# Altium schematic sheet PreAmplifierVoltageA.SchDoc
size A4; SheetNumber: 3; SheetTotal: 5
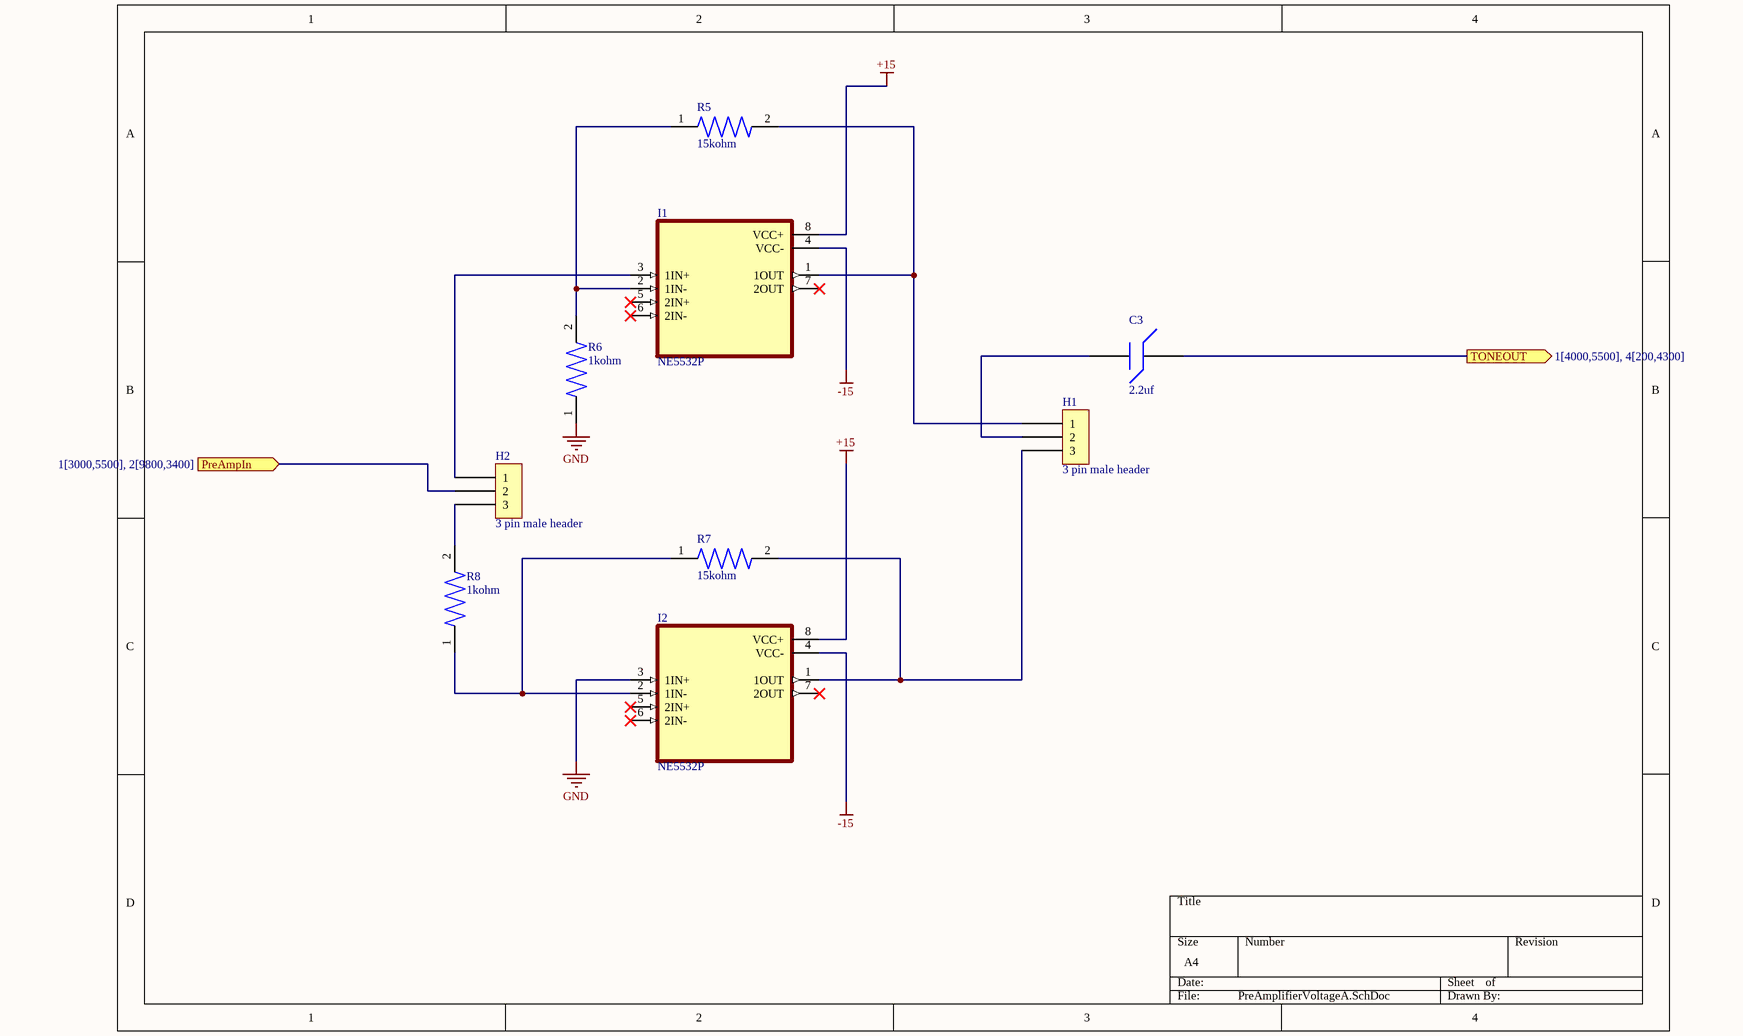
[diagram p0: PreAmplifierVoltageA.SchDoc]

## Parts
C3  2.2uf  [Capasitor]
H1  3 pin male header  [3 pin Male header]
H2  3 pin male header  [3 pin Male header]
I1  NE5532P  [NE5532P]
I2  NE5532P  [NE5532P]
R5  15kohm  [Resistor]
R6  1kohm  [Resistor]
R7  15kohm  [Resistor]
R8  1kohm  [Resistor]

## Ports
PreAmpIn (in, see 1[3000,5500], 2[9800,3400]), TONEOUT (out, see 1[4000,5500], 4[200,4300])

## Nets
+15: I1.8(VCC+) I2.8(VCC+)
-15: I1.4(VCC-) I2.4(VCC-)
GND: I2.3(1IN+) R6.1
PreAmpIn: H2.2 ; port PreAmpIn
TONEOUT: C3.2 ; port TONEOUT
NetC3_1: C3.1 H1.2
NetH1_1: H1.1 I1.1(1OUT) R5.2
NetH1_3: H1.3 I2.1(1OUT) R7.2
NetH2_1: H2.1 I1.3(1IN+)
NetH2_3: H2.3 R8.2
NetI1_2: I1.2(1IN-) R5.1 R6.2
NetI2_2: I2.2(1IN-) R7.1 R8.1

Not connected (* = marked no-connect by the designer): I1 5(2IN+)* 6(2IN-)* 7(2OUT)*; I2 5(2IN+)* 6(2IN-)* 7(2OUT)*

## Library data of the parts
C3 = 400LLE2R2MEFC8X11.5: Aluminum Electrolytic Capacitor, Polarized, Aluminum (wet), 400V, 20% +Tol, 20% -Tol, 2.2uF, Through Hole Mount; Manufacturer: Rubycon; Supplier: Digikey; Supplier Part Number: 1189-1329-ND; Manufacturer Part Number: 400LLE2R2MEFC8X11.5; RoHS: Yes; Category: Aluminum Electrolytic Capacitors; Stock: 36469; Pricing: 1=0.53, 10=0.326, 50=0.2416, 100=0.2148, 500=0.16848, 2000=0.14171, 4000=0.1316, 6000=0.1265 (USD); ComponentLink1URL: https://datasheet.ciiva.com:443/pdfs/VipMasterIC/IC/RUBY/RUBYS01654/RUBYS01654-1.pdf?src-supplier=IHS+Markit; ComponentLink1Description: https://datasheet.ciiva.com:443/pdfs/VipMasterIC/IC/RUBY/RUBYS01654/RUBYS01654-1.pdf?src-supplier=IHS+Markit; ComponentLink2URL: https://datasheet.ciiva.com/29544/e-lle-29544381.pdf?src-supplier=Digikey; ComponentLink2Description: https://datasheet.ciiva.com/29544/e-lle-29544381.pdf?src-supplier=Digikey
H1 H2 = M20-9990345: Board Connector, 3 Contact(s), 1 Row(s), Male, Straight, 0.1 inch Pitch, Solder Terminal, Locking, Black Insulator; Manufacturer: Harwin; Option: General Purpose; Additional Feature: ROHS COMPLIANT; Body/Shell Style: RECEPTACLE; Contact Pattern: RECTANGULAR; Contact Resistance: 25mR; Dielectric Withstanding Voltage (AC): 750V; Durability: 300Cycles; Filter Feature: No; Insulation Resistance: 1GR; Number Of Connectors: 1; Rated Current (Signal): 3A; Number of Contacts: 3; Body Length: 0.3inch; Reference Standard: UL; Reliability: COMMERCIAL; Supplier: Digikey; Supplier Part Number: 952-2263-ND; Manufacturer Part Number: M20-9990345; RoHS: Yes; Category: Headers and Wire Housings; Stock: 57860; Pricing: 1=0.15, 10=0.124, 100=0.1053, 500=0.09398, 1000=0.08949, 5000=0.07987, 10000=0.07606 (USD); Mounting Technology: Board; Contact Material: Brass; Contact Finish - Mating: GOLD; Contact Finish - Termination: Gold (Au) - with Nickel (Ni) barrier; Insulation Color: Black; Insulation Material: Nylon; Min Operating Temperature: -40°C; Max Operating Temperature: 105°C; Connector Type: BOARD CONNECTOR; JESD-609 Code: e4; Contact Gender: Male; Mixed Contacts: No; Mounting Style: STRAIGHT; Number Of PCB Rows: 1; Number of Rows Loaded: 1; Termination: Solder; Body Breadth: 0.1inch; Body Depth: 0.1inch; Mating Contact Pitch: 0.1inch; Mounting Option 1: LOCKING; Terminal Length: 0.118inch; Terminal Pitch: 2.54mm; Flammability Rating: UL94 V-0; DIN Conformance: No; IEC Conformance: No; MIL Conformance: No; Reach SVHC Compliant: Yes; RoHS Compliant: Yes; ComponentLink1URL: https://datasheet.ciiva.com:443/pdfs/VipMasterIC/IC/HRWN/HRWN-S-A0003033920/HRWN-S-A0003397280-1.pdf?src-supplier=IHS+Markit; ComponentLink1Description: https://datasheet.ciiva.com:443/pdfs/VipMasterIC/IC/HRWN/HRWN-S-A0003033920/HRWN-S-A0003397280-1.pdf?src-supplier=IHS+Markit; ComponentLink2URL: https://datasheet.ciiva.com/11747/0900766b80da602d-11747505.pdf?src-supplier=Rs; ComponentLink2Description: https://datasheet.ciiva.com/11747/0900766b80da602d-11747505.pdf?src-supplier=Rs; ComponentLink3URL: https://datasheet.ciiva.com/5160/m20-999-351179-5160492.pdf?src-supplier=Mouser; ComponentLink3Description: https://datasheet.ciiva.com/5160/m20-999-351179-5160492.pdf?src-supplier=Mouser; ComponentLink4URL: https://datasheet.ciiva.com/10151/m20-999-10151334.pdf?src-supplier=Avnet; ComponentLink4Description: https://datasheet.ciiva.com/10151/m20-999-10151334.pdf?src-supplier=Avnet
I1 I2 = NE5532P: Operational Amplifier, 2 Func, 5000uV Offset-Max, BIPolar, PDIP8; Manufacturer: Texas Instruments; Package Body Material: Plastic; Architecture: VOLTAGE-FEEDBACK; Average Bias Current-Max (IIB): 1uA; Bias Current-Max (IIB) @25C: 800nA; Common-mode Reject Ratio-Nom: 100dB; Frequency Compensation: YES; Input Offset Voltage-Max: 5mV; Low-Offset: No; Neg Supply Voltage Limit-Max: -22V; Neg Supply Voltage-Nom (Vsup): -15V; Channels: 2; Package Equivalence Code: DIP8,.3; Power Supplies: +-5/+-15/10/30V; Slew Rate: 9V/µs; Max Supply Current: 16mA; Supply Voltage Limit-Max: 22V; Nominal Supply Voltage: 15V; Surface Mount: No; Unity Gain BW-Nom: 10MHz; Voltage Gain-Min: 10000; Common Mode Rejection Ratio-Min: 70dB; Qualification Status: Not Qualified; Supplier: Mouser; Supplier Part Number: 595-NE5532P; Manufacturer Part Number: NE5532P; RoHS: Yes; Category: Amplifiers - Op Amps, Buffer, Instrumentation; Stock: 14297; Pricing: 1=0.57, 10=0.402, 50=0.335, 100=0.313, 1000=0.266, 10000=0.254 (USD); Case/Package: DIP; Pins: 8; Package Shape: Rectangular; Terminal Finish: Tin; Min Operating Temperature: 0°C; Max Operating Temperature: 70°C; JESD-609 Code: e3; Amplifier Type: OPERATIONAL AMPLIFIER; JESD-30 Code: R-PDIP-T8; Package Style: IN-LINEMeter; Packaging: Rail/Tube; Technology: BIPOLAR; Terminal Form: Through Hole; Terminal Position: DUAL; Length: 9.81mm; Width: 7.62mm; Height - Seated (Max): 5.08mm; Terminal Pitch: 2.54mm; Temperature Grade: COMMERCIAL; Reach SVHC Compliant: Yes; RoHS Compliant: Yes; ComponentLink1URL: https://www.ti.com:443/lit/ds/symlink/ne5532.pdf?src-supplier=IHS+Markit; ComponentLink1Description: https://www.ti.com:443/lit/ds/symlink/ne5532.pdf?src-supplier=IHS+Markit; ComponentLink2URL: https://datasheet.ciiva.com/14151/jyne5532-e-14151126.pdf?src-supplier=Distrelec; ComponentLink2Description: https://datasheet.ciiva.com/14151/jyne5532-e-14151126.pdf?src-supplier=Distrelec; ComponentLink3URL: https://datasheet.ciiva.com/27050/903963-27050795.pdf?src-supplier=Jameco; ComponentLink3Description: https://datasheet.ciiva.com/27050/903963-27050795.pdf?src-supplier=Jameco; ComponentLink4URL: https://datasheet.ciiva.com/15129/getdatasheetpartid-41254-15129711.pdf?src-supplier=Verical; ComponentLink4Description: https://datasheet.ciiva.com/15129/getdatasheetpartid-41254-15129711.pdf?src-supplier=Verical; ComponentLink5URL: https://datasheet.ciiva.com/26325/151768-da-01-en-ne-5532p-26325914.pdf?src-supplier=Conrad; ComponentLink5Description: https://datasheet.ciiva.com/26325/151768-da-01-en-ne-5532p-26325914.pdf?src-supplier=Conrad; ComponentLink6URL: https://datasheet.ciiva.com/1803/ne5532-1803186.pdf?src-supplier=Digikey; ComponentLink6Description: https://datasheet.ciiva.com/1803/ne5532-1803186.pdf?src-supplier=Digikey; ComponentLink7URL: https://datasheet.ciiva.com/2973/sa5532a-2973704.pdf?src-supplier=Avnet; ComponentLink7Description: https://datasheet.ciiva.com/2973/sa5532a-2973704.pdf?src-supplier=Avnet
R5 R7 = CFM12JT15K0: Fixed Resistor, Carbon Film, 0.5W, 15000ohm, 350V, 5% +/-Tol, -500,0ppm/Cel, Through Hole Mount; Manufacturer: Stackpole Electronics; Power: 500mW; Rated Temperature: 70°C; Value: 15kR; Temperature Coefficient (ppm/Cel): 500; Lead Diameter: 0.55mm; Lead Length: 28mm; Package Length: 6mm; Supplier: Digikey; Supplier Part Number: S15KHCT-ND; Manufacturer Part Number: CFM12JT15K0; RoHS: Yes; Category: Through-Hole Resistors; Stock: 89193; Pricing: 1=0.1, 10=0.031, 25=0.0256, 50=0.0224, 100=0.0197, 250=0.01668, 500=0.01478, 1000=0.01316 (USD); Mounting Technology: Through Hole; Pins: 2; Package Shape: Tubular; Terminal Finish: Tin; Min Operating Temperature: -55°C; Max Operating Temperature: 155°C; Tolerance: 5%; JESD-609 Code: e3; Resistor Type: FIXED RESISTOR; Construction: Tubular; Package Style: AXIAL; Packaging: Tape and Reel; Technology: CARBON FILM; Termination: Wire; Working Voltage: 350V; Reach SVHC Compliant: Yes; RoHS Compliant: Yes; ComponentLink1URL: https://datasheet.ciiva.com:443/pdfs/VipMasterIC/IC/SEIE/SEIE-S-A0009883960/SEIE-S-A0009883960-1.pdf?src-supplier=IHS+Markit; ComponentLink1Description: https://datasheet.ciiva.com:443/pdfs/VipMasterIC/IC/SEIE/SEIE-S-A0009883960/SEIE-S-A0009883960-1.pdf?src-supplier=IHS+Markit; ComponentLink2URL: https://www.seielect.com/catalog/SEI-Packaging.pdf?src-supplier=Digikey; ComponentLink2Description: https://www.seielect.com/catalog/SEI-Packaging.pdf?src-supplier=Digikey; ComponentLink3URL: https://www.seielect.com/catalog/sei-cf_cfm.pdf?src-supplier=Digikey; ComponentLink3Description: https://www.seielect.com/catalog/sei-cf_cfm.pdf?src-supplier=Digikey; ComponentLink4URL: https://www.seielect.com/catalog/SEI-CF_CFM.pdf?src-supplier=Avnet; ComponentLink4Description: https://www.seielect.com/catalog/SEI-CF_CFM.pdf?src-supplier=Avnet
R6 R8 = CF14JT1K00: Fixed Resistor, Carbon Film, 0.25W, 1000ohm, 350V, 5% +/-Tol, -400,0ppm/Cel, Through Hole Mount; Manufacturer: Stackpole Electronics; Power: 250mW; Rated Temperature: 70°C; Value: 1kR; Temperature Coefficient (ppm/Cel): 400; Lead Diameter: 0.55mm; Lead Length: 28mm; Package Length: 6mm; Supplier: Digikey; Supplier Part Number: CF14JT1K00CT-ND; Manufacturer Part Number: CF14JT1K00; RoHS: Yes; Category: Through-Hole Resistors; Stock: 680385; Pricing: 1=0.1, 10=0.026, 25=0.022, 50=0.0192, 100=0.0169, 250=0.01424, 500=0.0126, 1000=0.0112 (USD); Mounting Technology: Through Hole; Pins: 2; Package Shape: Tubular; Terminal Finish: Tin; Min Operating Temperature: -55°C; Max Operating Temperature: 155°C; Tolerance: 5%; Resistor Type: FIXED RESISTOR; Construction: Tubular; Package Style: AXIAL; Packaging: Tape and Reel; Technology: CARBON FILM; Termination: Wire; Working Voltage: 350V; JESD-609 Code: e3; Reach SVHC Compliant: Yes; RoHS Compliant: Yes; ComponentLink1URL: https://datasheet.ciiva.com:443/pdfs/VipMasterIC/IC/SEIE/SEIE-S-A0009883960/SEIE-S-A0009883960-1.pdf?src-supplier=IHS+Markit; ComponentLink1Description: https://datasheet.ciiva.com:443/pdfs/VipMasterIC/IC/SEIE/SEIE-S-A0009883960/SEIE-S-A0009883960-1.pdf?src-supplier=IHS+Markit; ComponentLink2URL: https://www.seielect.com/catalog/SEI-Packaging.pdf?src-supplier=Digikey; ComponentLink2Description: https://www.seielect.com/catalog/SEI-Packaging.pdf?src-supplier=Digikey; ComponentLink3URL: https://www.seielect.com/Catalog/SEI-CF_CFM.pdf?src-supplier=Digikey; ComponentLink3Description: https://www.seielect.com/Catalog/SEI-CF_CFM.pdf?src-supplier=Digikey; ComponentLink4URL: https://www.seielect.com/catalog/SEI-CF_CFM.pdf?src-supplier=Avnet; ComponentLink4Description: https://www.seielect.com/catalog/SEI-CF_CFM.pdf?src-supplier=Avnet; ComponentLink5URL: http://components.arrow.com/part/dataview/27620077S9848643N1174?src-supplier=Arrow+Electronics; ComponentLink5Description: http://components.arrow.com/part/dataview/27620077S9848643N1174?src-supplier=Arrow+Electronics; ComponentLink6URL: http://www.seielect.com/Catalog/SEI-CF_CFM.pdf?src-supplier=Future+Electronics; ComponentLink6Description: http://www.seielect.com/Catalog/SEI-CF_CFM.pdf?src-supplier=Future+Electronics; ComponentLink7URL: https://datasheet.octopart.com/CF14JT1K00-Stackpole-Electronics-datasheet-8360004.pdf?src-supplier=Future+Electronics; ComponentLink7Description: https://datasheet.octopart.com/CF14JT1K00-Stackpole-Electronics-datasheet-8360004.pdf?src-supplier=Future+Electronics; ComponentLink8URL: https://www.verical.com/server-webapp/html/getDatasheet?partID=360403&src-supplier=Verical; ComponentLink8Description: https://www.verical.com/server-webapp/html/getDatasheet?partID=360403&src-supplier=Verical; ComponentLink9URL: https://datasheet.octopart.com/CF14JT1K00-Stackpole-Electronics-datasheet-32780772.pdf?src-supplier=Master+Electronics; ComponentLink9Description: https://datasheet.octopart.com/CF14JT1K00-Stackpole-Electronics-datasheet-32780772.pdf?src-supplier=Master+Electronics